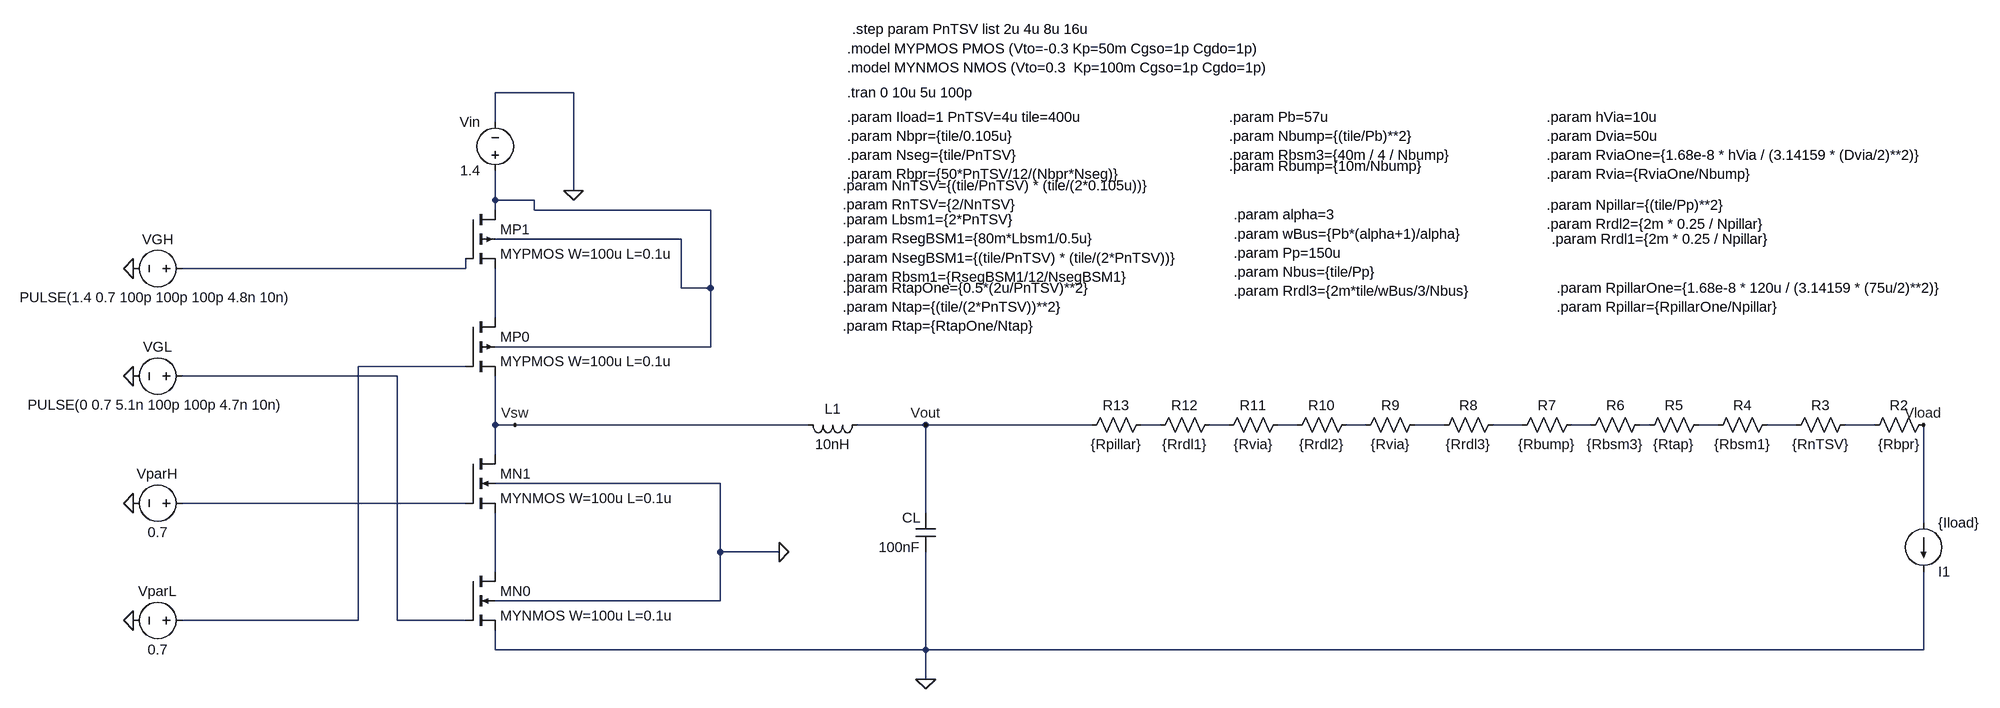
[diagram p0: schematic BuckConverter-WithLayers.asc]
BuckConverter-WithLayers.asc, the LTspice schematic file:
Version 4.1
SHEET 1 2640 948
WIRE 288 -32 160 -32
WIRE 160 16 160 -32
WIRE 288 128 288 -32
WIRE 160 144 160 96
WIRE 224 144 160 144
WIRE 160 160 160 144
WIRE 224 160 224 144
WIRE 512 160 224 160
WIRE 464 208 160 208
WIRE 112 256 112 240
WIRE 112 256 -352 256
WIRE 464 288 464 208
WIRE 512 288 512 160
WIRE 512 288 464 288
WIRE 160 336 160 256
WIRE 512 384 512 288
WIRE 512 384 160 384
WIRE 112 416 -64 416
WIRE 0 432 -352 432
WIRE 160 512 160 432
WIRE 192 512 160 512
WIRE 672 512 192 512
WIRE 864 512 752 512
WIRE 1136 512 864 512
WIRE 1248 512 1216 512
WIRE 1360 512 1328 512
WIRE 1472 512 1440 512
WIRE 1584 512 1552 512
WIRE 1712 512 1664 512
WIRE 1840 512 1792 512
WIRE 1952 512 1920 512
WIRE 2048 512 2032 512
WIRE 2160 512 2128 512
WIRE 2288 512 2240 512
WIRE 2416 512 2368 512
WIRE 160 560 160 512
WIRE 528 608 160 608
WIRE 112 640 -352 640
WIRE 864 656 864 512
WIRE 2496 672 2496 512
WIRE 528 720 528 608
WIRE 624 720 528 720
WIRE 160 752 160 656
WIRE 528 800 528 720
WIRE 528 800 160 800
WIRE -64 832 -64 416
WIRE -64 832 -352 832
WIRE 0 832 0 432
WIRE 112 832 0 832
WIRE 160 880 160 848
WIRE 864 880 864 720
WIRE 864 880 160 880
WIRE 2496 880 2496 752
WIRE 2496 880 864 880
WIRE 864 928 864 880
FLAG 192 512 Vsw
FLAG 288 128 0
FLAG -432 256 0
FLAG -432 432 0
FLAG -432 640 0
FLAG -432 832 0
FLAG 624 720 0
FLAG 864 512 Vout
FLAG 864 928 0
FLAG 2496 512 Vload
SYMBOL voltage 160 112 R180
WINDOW 0 24 96 Left 2
WINDOW 3 24 16 Left 2
WINDOW 123 0 0 Left 0
WINDOW 39 0 0 Left 0
SYMATTR InstName Vin
SYMATTR Value 1.4
SYMBOL voltage -336 256 R90
WINDOW 0 -32 56 VBottom 2
WINDOW 3 32 56 VTop 2
WINDOW 123 0 0 Left 0
WINDOW 39 0 0 Left 0
SYMATTR InstName VGH
SYMATTR Value PULSE(1.4 0.7 100p 100p 100p 4.8n 10n)
SYMBOL voltage -336 432 R90
WINDOW 0 -32 56 VBottom 2
WINDOW 3 32 56 VTop 2
WINDOW 123 0 0 Left 0
WINDOW 39 0 0 Left 0
SYMATTR InstName VGL
SYMATTR Value PULSE(0 0.7 5.1n 100p 100p 4.7n 10n)
SYMBOL voltage -336 640 R90
WINDOW 0 -32 56 VBottom 2
WINDOW 3 32 56 VTop 2
WINDOW 123 0 0 Left 0
WINDOW 39 0 0 Left 0
SYMATTR InstName VparH
SYMATTR Value 0.7
SYMBOL voltage -336 832 R90
WINDOW 0 -32 56 VBottom 2
WINDOW 3 32 56 VTop 2
WINDOW 123 0 0 Left 0
WINDOW 39 0 0 Left 0
SYMATTR InstName VparL
SYMATTR Value 0.7
SYMBOL pmos4 112 160 R0
SYMATTR InstName MP1
SYMATTR Value MYPMOS W=100u L=0.1u
SYMBOL pmos4 112 336 R0
SYMATTR InstName MP0
SYMATTR Value MYPMOS W=100u L=0.1u
SYMBOL nmos4 112 560 R0
SYMATTR InstName MN1
SYMATTR Value MYNMOS W=100u L=0.1u
SYMBOL nmos4 112 752 R0
SYMATTR InstName MN0
SYMATTR Value MYNMOS W=100u L=0.1u
SYMBOL cap 880 720 R180
WINDOW 0 24 56 Left 2
WINDOW 3 24 8 Left 2
SYMATTR InstName CL
SYMATTR Value 100nF
SYMBOL ind 768 496 R90
WINDOW 0 5 56 VBottom 2
WINDOW 3 32 56 VTop 2
SYMATTR InstName L1
SYMATTR Value 10nH
SYMBOL res 2512 496 R90
WINDOW 0 0 56 VBottom 2
WINDOW 3 32 56 VTop 2
SYMATTR InstName R2
SYMATTR Value {Rbpr}
SYMBOL current 2496 672 R0
WINDOW 0 24 80 Left 2
WINDOW 3 24 0 Left 2
WINDOW 123 0 0 Left 0
WINDOW 39 0 0 Left 0
SYMATTR InstName I1
SYMATTR Value {Iload}
SYMBOL res 2384 496 R90
WINDOW 0 0 56 VBottom 2
WINDOW 3 32 56 VTop 2
SYMATTR InstName R3
SYMATTR Value {RnTSV}
SYMBOL res 2256 496 R90
WINDOW 0 0 56 VBottom 2
WINDOW 3 32 56 VTop 2
SYMATTR InstName R4
SYMATTR Value {Rbsm1}
SYMBOL res 2144 496 R90
WINDOW 0 0 56 VBottom 2
WINDOW 3 32 56 VTop 2
SYMATTR InstName R5
SYMATTR Value {Rtap}
SYMBOL res 2048 496 R90
WINDOW 0 0 56 VBottom 2
WINDOW 3 32 56 VTop 2
SYMATTR InstName R6
SYMATTR Value {Rbsm3}
SYMBOL res 1936 496 R90
WINDOW 0 0 56 VBottom 2
WINDOW 3 32 56 VTop 2
SYMATTR InstName R7
SYMATTR Value {Rbump}
SYMBOL res 1808 496 R90
WINDOW 0 0 56 VBottom 2
WINDOW 3 32 56 VTop 2
SYMATTR InstName R8
SYMATTR Value {Rrdl3}
SYMBOL res 1680 496 R90
WINDOW 0 0 56 VBottom 2
WINDOW 3 32 56 VTop 2
SYMATTR InstName R9
SYMATTR Value {Rvia}
SYMBOL res 1568 496 R90
WINDOW 0 0 56 VBottom 2
WINDOW 3 32 56 VTop 2
SYMATTR InstName R10
SYMATTR Value {Rrdl2}
SYMBOL res 1456 496 R90
WINDOW 0 0 56 VBottom 2
WINDOW 3 32 56 VTop 2
SYMATTR InstName R11
SYMATTR Value {Rvia}
SYMBOL res 1344 496 R90
WINDOW 0 0 56 VBottom 2
WINDOW 3 32 56 VTop 2
SYMATTR InstName R12
SYMATTR Value {Rrdl1}
SYMBOL res 1232 496 R90
WINDOW 0 0 56 VBottom 2
WINDOW 3 32 56 VTop 2
SYMATTR InstName R13
SYMATTR Value {Rpillar}
TEXT 736 -104 Left 2 !.model MYPMOS PMOS (Vto=-0.3 Kp=50m Cgso=1p Cgdo=1p)\n.model MYNMOS NMOS (Vto=0.3  Kp=100m Cgso=1p Cgdo=1p)
TEXT 736 -32 Left 2 !.tran 0 10u 5u 100p
TEXT 736 8 Left 2 !.param Iload=1 PnTSV=4u tile=400u\n.param Nbpr={tile/0.105u}\n.param Nseg={tile/PnTSV}\n.param Rbpr={50*PnTSV/12/(Nbpr*Nseg)}
TEXT 728 120 Left 2 !.param NnTSV={(tile/PnTSV) * (tile/(2*0.105u))}\n.param RnTSV={2/NnTSV}
TEXT 728 176 Left 2 !.param Lbsm1={2*PnTSV}\n.param RsegBSM1={80m*Lbsm1/0.5u}\n.param NsegBSM1={(tile/PnTSV) * (tile/(2*PnTSV))}\n.param Rbsm1={RsegBSM1/12/NsegBSM1}
TEXT 728 288 Left 2 !.param RtapOne={0.5*(2u/PnTSV)**2}\n.param Ntap={(tile/(2*PnTSV))**2}\n.param Rtap={RtapOne/Ntap}
TEXT 1360 8 Left 2 !.param Pb=57u\n.param Nbump={(tile/Pb)**2}\n.param Rbsm3={40m / 4 / Nbump}
TEXT 1360 88 Left 2 !.param Rbump={10m/Nbump}
TEXT 1368 168 Left 2 !.param alpha=3\n.param wBus={Pb*(alpha+1)/alpha}\n.param Pp=150u\n.param Nbus={tile/Pp}\n.param Rrdl3={2m*tile/wBus/3/Nbus}
TEXT 1880 8 Left 2 !.param hVia=10u\n.param Dvia=50u\n.param RviaOne={1.68e-8 * hVia / (3.14159 * (Dvia/2)**2)}\n.param Rvia={RviaOne/Nbump}
TEXT 1880 152 Left 2 !.param Npillar={(tile/Pp)**2}\n.param Rrdl2={2m * 0.25 / Npillar}
TEXT 1888 208 Left 2 !.param Rrdl1={2m * 0.25 / Npillar}
TEXT 1896 288 Left 2 !.param RpillarOne={1.68e-8 * 120u / (3.14159 * (75u/2)**2)}\n.param Rpillar={RpillarOne/Npillar}
TEXT 744 -136 Left 2 !.step param PnTSV list 2u 4u 8u 16u

The netlist it stands for:
* BuckConverter-WithLayers.asc
Vin N001 0 1.4
VGH N002 0 PULSE(1.4 0.7 100p 100p 100p 4.8n 10n)
VGL N005 0 PULSE(0 0.7 5.1n 100p 100p 4.7n 10n)
VparH N017 0 0.7
VparL N004 0 0.7
MP1 N001 N002 N003 N001 MYPMOS W=100u L=0.1u
MP0 N003 N004 Vsw N001 MYPMOS W=100u L=0.1u
MN1 Vsw N017 N018 0 MYNMOS W=100u L=0.1u
MN0 N018 N005 0 0 MYNMOS W=100u L=0.1u
CL 0 Vout 100nF
L1 Vout Vsw 10nH
R2 Vload N016 {Rbpr}
I1 Vload 0 {Iload}
R3 N016 N015 {RnTSV}
R4 N015 N014 {Rbsm1}
R5 N014 N013 {Rtap}
R6 N013 N012 {Rbsm3}
R7 N012 N011 {Rbump}
R8 N011 N010 {Rrdl3}
R9 N010 N009 {Rvia}
R10 N009 N008 {Rrdl2}
R11 N008 N007 {Rvia}
R12 N007 N006 {Rrdl1}
R13 N006 Vout {Rpillar}
.model NMOS NMOS
.model PMOS PMOS
.lib standard.mos
.model MYPMOS PMOS (Vto=-0.3 Kp=50m Cgso=1p Cgdo=1p)
.model MYNMOS NMOS (Vto=0.3  Kp=100m Cgso=1p Cgdo=1p)
.tran 0 10u 5u 100p
.param Iload=1 PnTSV=4u tile=400u
.param Nbpr={tile/0.105u}
.param Nseg={tile/PnTSV}
.param Rbpr={50*PnTSV/12/(Nbpr*Nseg)}
.param NnTSV={(tile/PnTSV) * (tile/(2*0.105u))}
.param RnTSV={2/NnTSV}
.param Lbsm1={2*PnTSV}
.param RsegBSM1={80m*Lbsm1/0.5u}
.param NsegBSM1={(tile/PnTSV) * (tile/(2*PnTSV))}
.param Rbsm1={RsegBSM1/12/NsegBSM1}
.param RtapOne={0.5*(2u/PnTSV)**2}
.param Ntap={(tile/(2*PnTSV))**2}
.param Rtap={RtapOne/Ntap}
.param Pb=57u
.param Nbump={(tile/Pb)**2}
.param Rbsm3={40m / 4 / Nbump}
.param Rbump={10m/Nbump}
.param alpha=3
.param wBus={Pb*(alpha+1)/alpha}
.param Pp=150u
.param Nbus={tile/Pp}
.param Rrdl3={2m*tile/wBus/3/Nbus}
.param hVia=10u
.param Dvia=50u
.param RviaOne={1.68e-8 * hVia / (3.14159 * (Dvia/2)**2)}
.param Rvia={RviaOne/Nbump}
.param Npillar={(tile/Pp)**2}
.param Rrdl2={2m * 0.25 / Npillar}
.param Rrdl1={2m * 0.25 / Npillar}
.param RpillarOne={1.68e-8 * 120u / (3.14159 * (75u/2)**2)}
.param Rpillar={RpillarOne/Npillar}
.step param PnTSV list 2u 4u 8u 16u
.backanno
.end